# EAGLE design DorothiController (EAGLE 9.2.2)

## Sheet 1 of 3
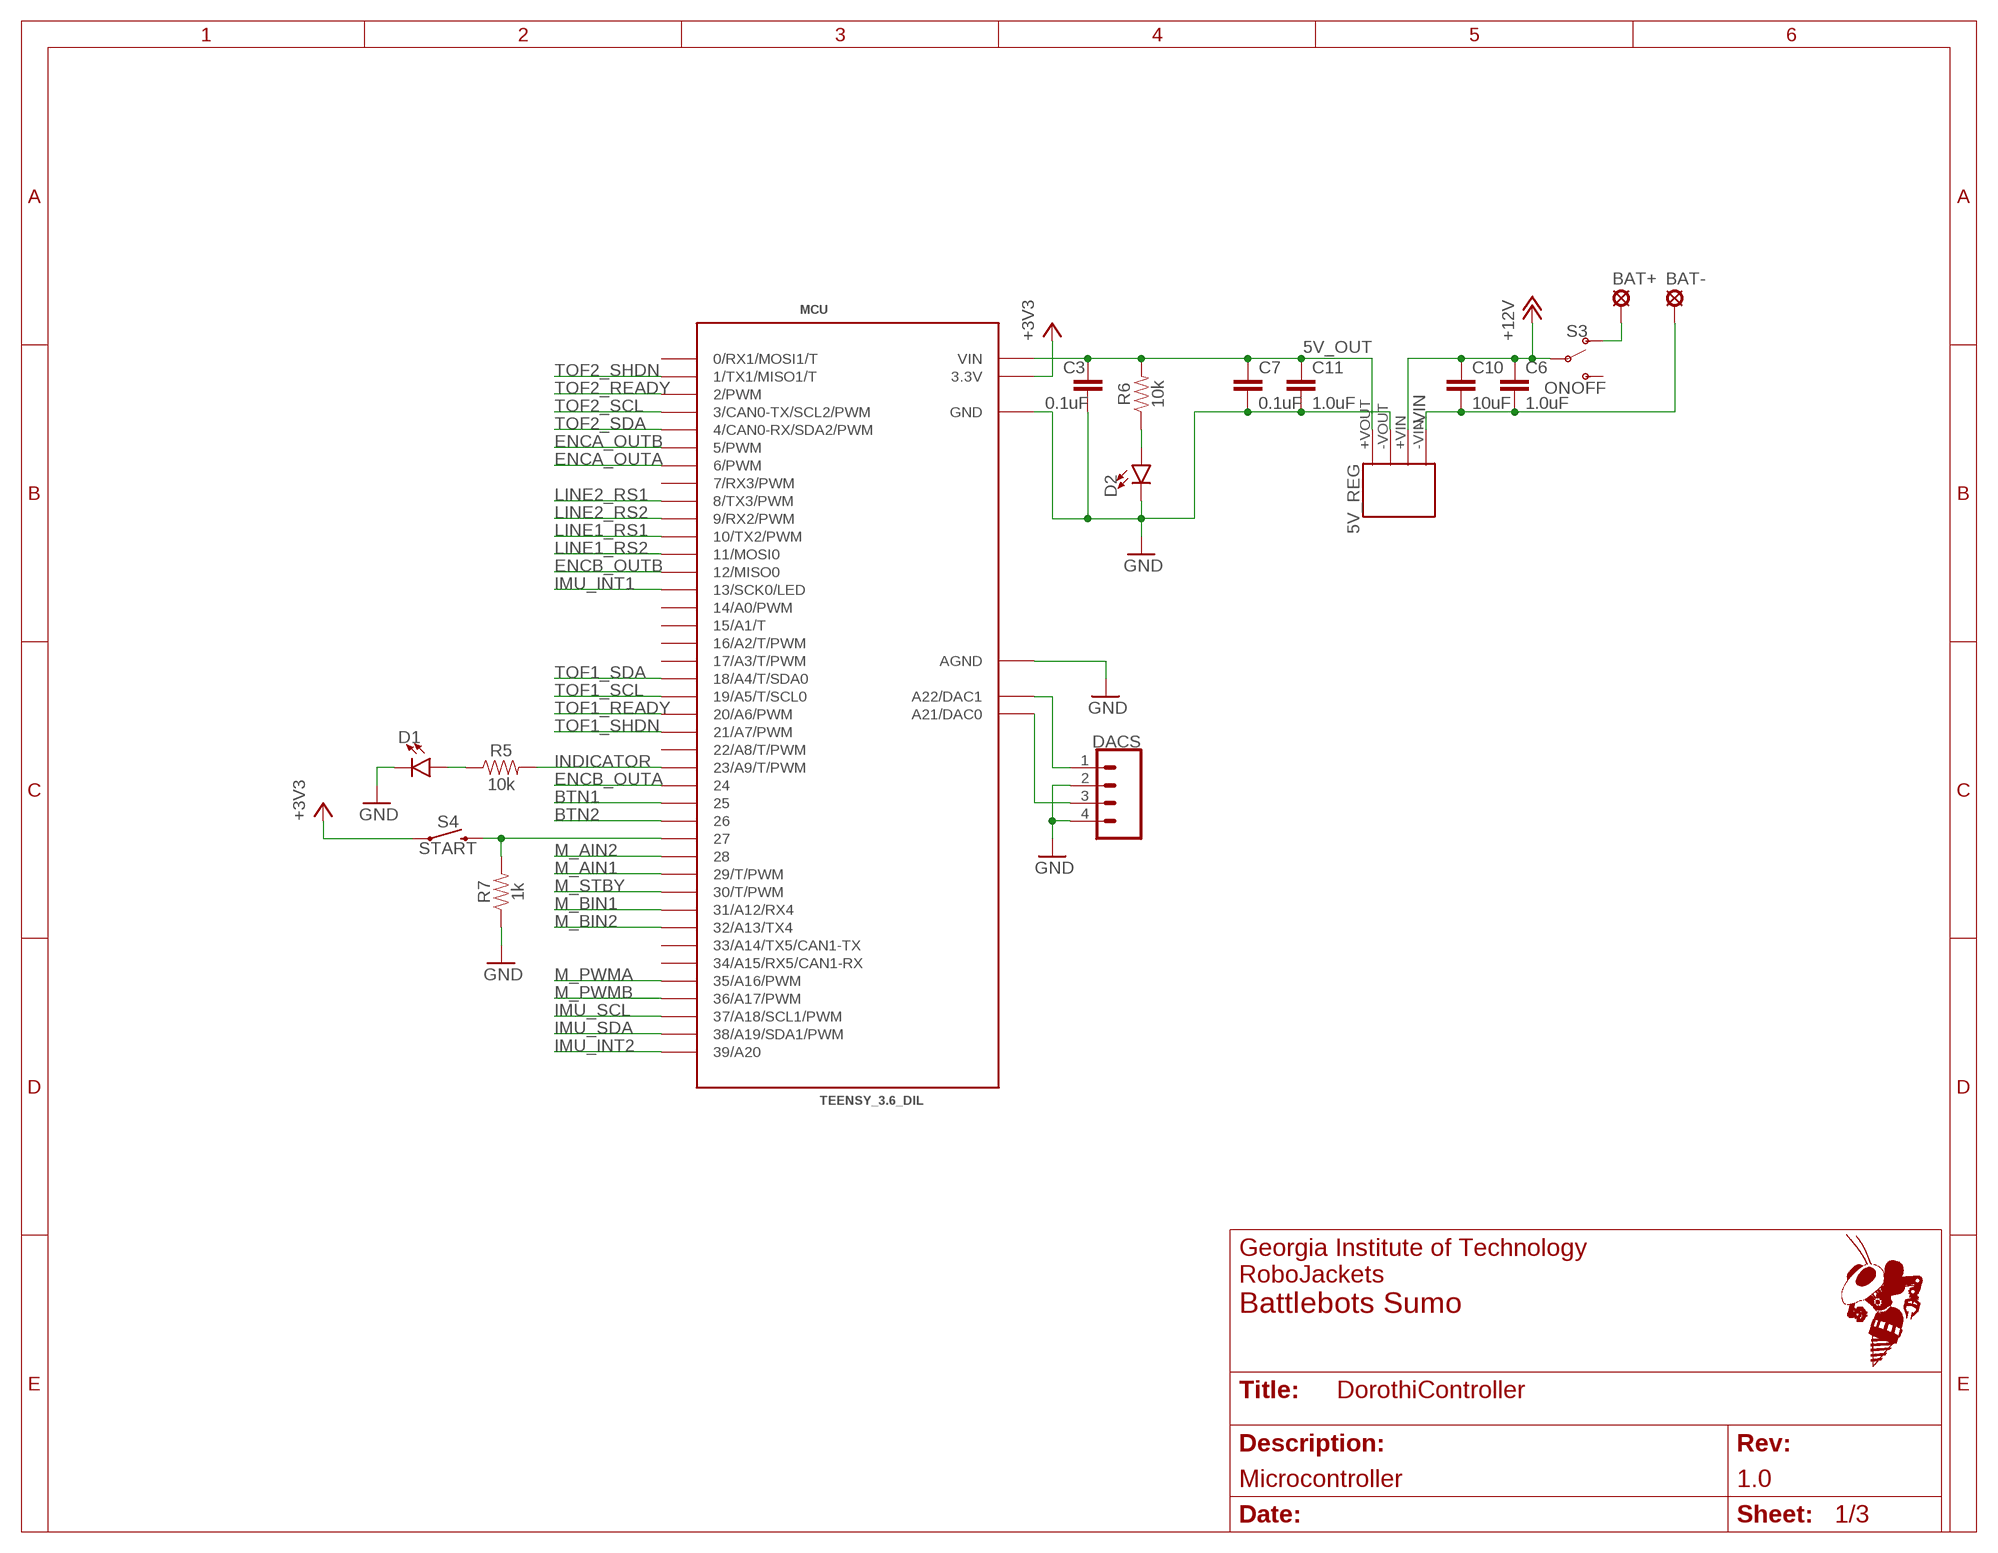
[diagram p0: schematic, sheet 1]
FRAME4 (FRAME_A_L): REVISION: 1.0; SCH_DESC: Microcontroller; TEAM: Battlebots Sumo

### Parts
5V_REG  CRE1S1205SC  [CRE1S1205SC]
BAT+  24_SOLPAD  [WIRE_SOLPAD]
BAT-  24_SOLPAD  [WIRE_SOLPAD]
C3  0.1uF  0.1UF-0603-25V-(+80/-20%)  [0603]
C6  1.0uF  1.0UF-0603-16V-10%  [0603]
C7  0.1uF  0.1UF-0603-25V-(+80/-20%)  [0603]
C10  10uF  10UF-0603-6.3V-20%  [0603]
C11  1.0uF  1.0UF-0603-16V-10%  [0603]
D1  LED0603  [LED-0603]
D2  LED0603  [LED-0603]
DACS  CONN_04  [1X04]
MCU  TEENSY_3.6_DIL  [TEENSY_3.6_DIL]
R5  10k  10KOHM-0603-1/10W-1%  [0603]
R6  10k  10KOHM-0603-1/10W-1%  [0603]
R7  1k  1KOHM-0603-1/10W-1%  [0603]
S3  ONOFF  SWITCH-SPDT-PTH-11.6X4.0MM  [SWITCH_SPDT_PTH_11.6X4.0MM]
S4  START  MOMENTARY-SWITCH-SPST-SMD-6.0X3.5MM  [TACTILE_SWITCH_SMD_6.0X3.5MM]

### Nets
5V_OUT: 5V_REG.+VOUT C3.1 C7.1 C11.1 MCU.VIN R6.2
+3V3: MCU.3.3V MCU.3.3V3(3.3V) S4.1 ; also sheet 2,3
+12V: 5V_REG.+VIN C6.1 C10.1 S3.2(P) ; also sheet 2
+VIN: BAT+.P$1(MP) S3.1(O)
-VIN: 5V_REG.-VIN BAT-.P$1(MP) C6.2 C10.2
BTN1: MCU.25 ; also sheet 3
BTN2: MCU.26 ; also sheet 3
DAC1: DACS.1 MCU.A22(A22/DAC1)
DAC2: DACS.3 MCU.A21(A21/DAC0)
ENCA_OUTA: MCU.6(6/PWM) ; also sheet 2
ENCA_OUTB: MCU.5(5/PWM) ; also sheet 2
ENCB_OUTA: MCU.24 ; also sheet 2
ENCB_OUTB: MCU.12(12/MISO0) ; also sheet 2
GND: 5V_REG.-VOUT C3.2 C7.2 C11.2 D1.C D2.C DACS.2 DACS.4 MCU.AGND MCU.GND MCU.GND1(GND) R7.1 ; also sheet 2,3
IMU_INT1: MCU.13(13/SCK0/LED) ; also sheet 3
IMU_INT2: MCU.39/A20 ; also sheet 3
IMU_SCL: MCU.37/A18(37/A18/SCL1/PWM) ; also sheet 3
IMU_SDA: MCU.38/A19(38/A19/SDA1/PWM) ; also sheet 3
INDICATOR: MCU.23/A9(23/A9/T/PWM) R5.2
LINE1_RS1: MCU.10(10/TX2/PWM) ; also sheet 3
LINE1_RS2: MCU.11(11/MOSI0) ; also sheet 3
LINE2_RS1: MCU.8(8/TX3/PWM) ; also sheet 3
LINE2_RS2: MCU.9(9/RX2/PWM) ; also sheet 3
M_AIN1: MCU.29(29/T/PWM) ; also sheet 2
M_AIN2: MCU.28 ; also sheet 2
M_BIN1: MCU.31/A12(31/A12/RX4) ; also sheet 2
M_BIN2: MCU.32/A13(32/A13/TX4) ; also sheet 2
M_PWMA: MCU.35/A16(35/A16/PWM) ; also sheet 2
M_PWMB: MCU.36/A17(36/A17/PWM) ; also sheet 2
M_STBY: MCU.30(30/T/PWM) ; also sheet 2
N$5: D1.A R5.1
N$7: D2.A R6.1
START: MCU.27 R7.2 S4.2
TOF1_READY: MCU.20/A6(20/A6/PWM) ; also sheet 3
TOF1_SCL: MCU.19/A5(19/A5/T/SCL0) ; also sheet 3
TOF1_SDA: MCU.18/A4(18/A4/T/SDA0) ; also sheet 3
TOF1_SHDN: MCU.21/A7(21/A7/PWM) ; also sheet 3
TOF2_READY: MCU.2(2/PWM) ; also sheet 3
TOF2_SCL: MCU.3(3/CAN0-TX/SCL2/PWM) ; also sheet 3
TOF2_SDA: MCU.4(4/CAN0-RX/SDA2/PWM) ; also sheet 3
TOF2_SHDN: MCU.1(1/TX1/MISO1/T) ; also sheet 3
Unconnected: MCU.0(0/RX1/MOSI1/T) MCU.7(7/RX3/PWM) MCU.14/A0(14/A0/PWM) MCU.15/A1(15/A1/T) MCU.16/A2(16/A2/T/PWM) MCU.17/A3(17/A3/T/PWM) MCU.22/A8(22/A8/T/PWM) MCU.33/A14(33/A14/TX5/CAN1-TX) MCU.34/A15(34/A15/RX5/CAN1-RX) S3.3(S)

## Sheet 2 of 3
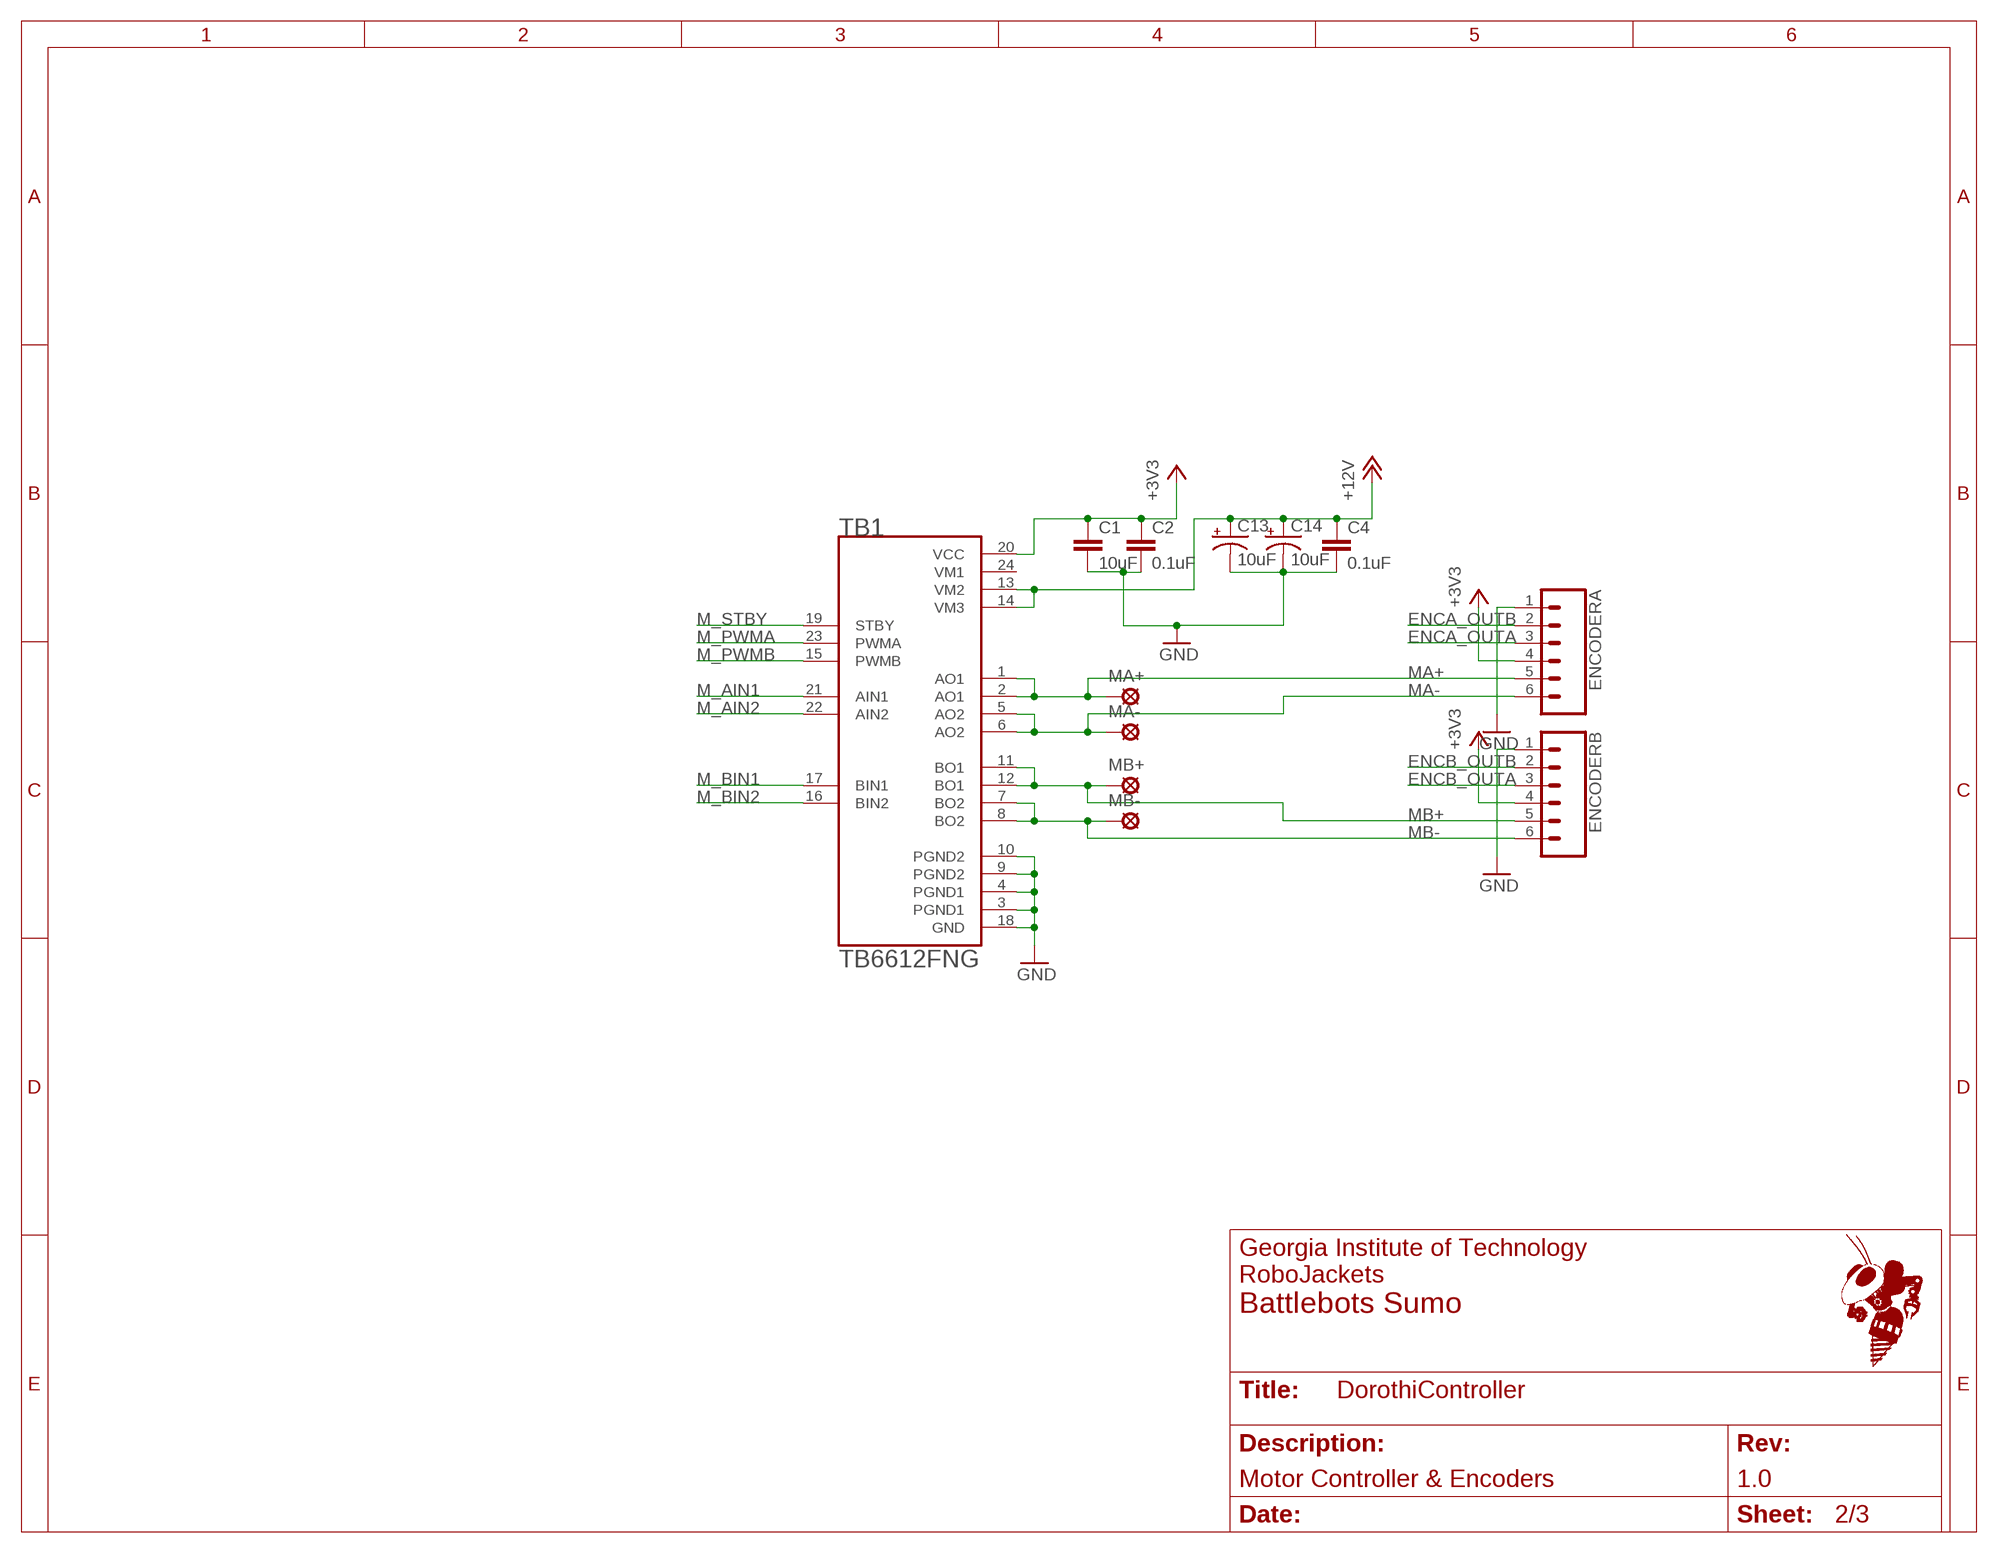
[diagram p1: schematic, sheet 2]
FRAME1 (FRAME_A_L): REVISION: 1.0; SCH_DESC: Motor Controller & Encoders; TEAM: Battlebots Sumo

### Parts
C1  10uF  10UF-0603-6.3V-20%  [0603]
C2  0.1uF  0.1UF-0603-25V-5%  [0603]
C4  0.1uF  0.1UF-0603-25V-5%  [0603]
C13  10uF  10UF-POLAR-0603-6.3V-20%(TANT)  [0603-POLAR]
C14  10uF  10UF-POLAR-0603-6.3V-20%(TANT)  [0603-POLAR]
ENCODERA  CONN_06SILK_FEMALE_PTH  [1X06]
ENCODERB  CONN_06SILK_FEMALE_PTH  [1X06]
MA+  24_SOLPAD  [WIRE_SOLPAD]
MA-  24_SOLPAD  [WIRE_SOLPAD]
MB+  24_SOLPAD  [WIRE_SOLPAD]
MB-  24_SOLPAD  [WIRE_SOLPAD]
TB1  TB6612FNG  TB6612FNG(O,C,8,EL  [SOP65P760X160-24N]

### Nets
+3V3: C1.1 C2.1 ENCODERA.4 ENCODERB.4 TB1.20(VCC) ; also sheet 1,3
+12V: C4.1 C13.+ C14.+ TB1.13(VM2) TB1.14(VM3) ; also sheet 1
ENCA_OUTA: ENCODERA.3 ; also sheet 1
ENCA_OUTB: ENCODERA.2 ; also sheet 1
ENCB_OUTA: ENCODERB.3 ; also sheet 1
ENCB_OUTB: ENCODERB.2 ; also sheet 1
GND: C1.2 C2.2 C4.2 C13.- C14.- ENCODERA.1 ENCODERB.1 TB1.3(PGND1) TB1.4(PGND1) TB1.9(PGND2) TB1.10(PGND2) TB1.18(GND) ; also sheet 1,3
M_AIN1: TB1.21(AIN1) ; also sheet 1
M_AIN2: TB1.22(AIN2) ; also sheet 1
M_BIN1: TB1.17(BIN1) ; also sheet 1
M_BIN2: TB1.16(BIN2) ; also sheet 1
M_PWMA: TB1.23(PWMA) ; also sheet 1
M_PWMB: TB1.15(PWMB) ; also sheet 1
M_STBY: TB1.19(STBY) ; also sheet 1
MA+: ENCODERA.5 MA+.P$1(MP) TB1.1(AO1) TB1.2(AO1)
MA-: ENCODERA.6 MA-.P$1(MP) TB1.5(AO2) TB1.6(AO2)
MB+: ENCODERB.5 MB+.P$1(MP) TB1.11(BO1) TB1.12(BO1)
MB-: ENCODERB.6 MB-.P$1(MP) TB1.7(BO2) TB1.8(BO2)

## Sheet 3 of 3
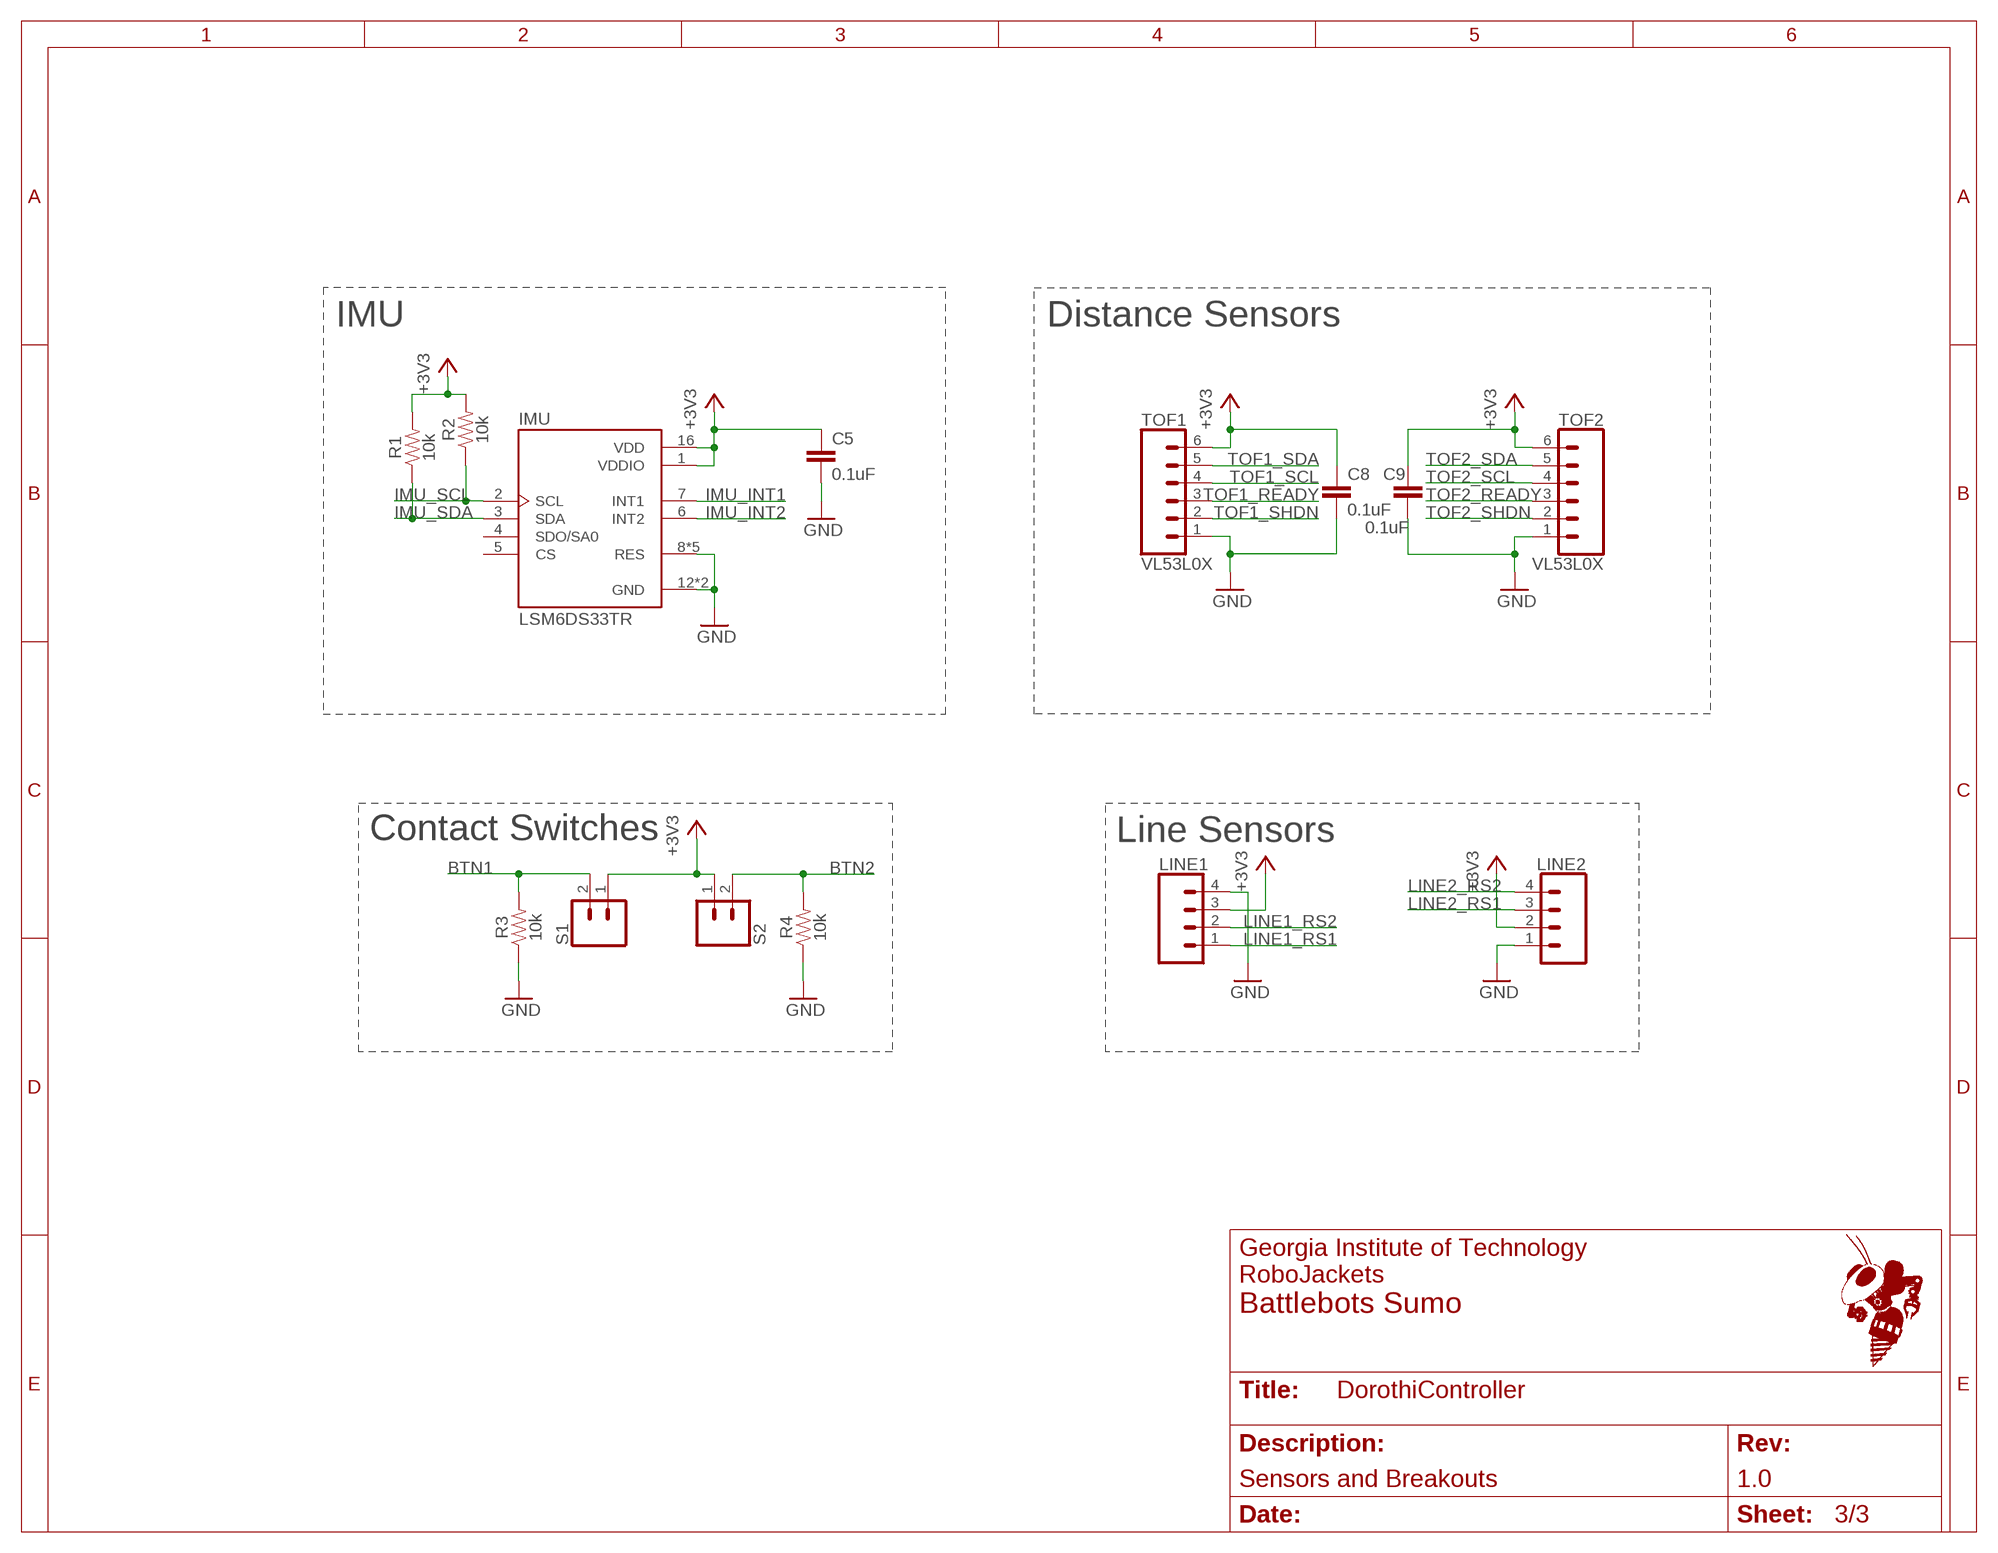
[diagram p2: schematic, sheet 3]
FRAME2 (FRAME_A_L): REVISION: 1.0; SCH_DESC: Sensors and Breakouts; TEAM: Battlebots Sumo

### Parts
C5  0.1uF  0.1UF-0603-25V-5%  [0603]
C8  0.1uF  0.1UF-0603-25V-5%  [0603]
C9  0.1uF  0.1UF-0603-25V-5%  [0603]
IMU  LSM6DS33TR  [PQFN50P300X300X86-16N]
LINE1  CONN_04  [1X04]
LINE2  CONN_04  [1X04]
R1  10k  10KOHM-0603-1/10W-1%  [0603]
R2  10k  10KOHM-0603-1/10W-1%  [0603]
R3  10k  10KOHM-0603-1/10W-1%  [0603]
R4  10k  10KOHM-0603-1/10W-1%  [0603]
S1  CONN_02  [1X02]
S2  CONN_02  [1X02]
TOF1  VL53L0X  CONN_06SILK_FEMALE_PTH  [1X06]
TOF2  VL53L0X  CONN_06SILK_FEMALE_PTH  [1X06]

### Nets
+3V3: C5.1 C8.1 C9.1 IMU.1(VDDIO) IMU.16(VDD) LINE1.3 LINE2.2 R1.2 R2.2 S1.1 S2.1 TOF1.6 TOF2.6 ; also sheet 1,2
BTN1: R3.2 S1.2 ; also sheet 1
BTN2: R4.2 S2.2 ; also sheet 1
GND: C5.2 C8.2 C9.2 IMU.8(RES) IMU.9(RES) IMU.10(RES) IMU.11(RES) IMU.12(GND) IMU.13(GND) IMU.15(RES) LINE1.4 LINE2.1 R3.1 R4.1 TOF1.1 TOF2.1 ; also sheet 1,2
IMU_INT1: IMU.7(INT1) ; also sheet 1
IMU_INT2: IMU.6(INT2) ; also sheet 1
IMU_SCL: IMU.2(SCL) R2.1 ; also sheet 1
IMU_SDA: IMU.3(SDA) R1.1 ; also sheet 1
LINE1_RS1: LINE1.1 ; also sheet 1
LINE1_RS2: LINE1.2 ; also sheet 1
LINE2_RS1: LINE2.3 ; also sheet 1
LINE2_RS2: LINE2.4 ; also sheet 1
TOF1_READY: TOF1.3 ; also sheet 1
TOF1_SCL: TOF1.4 ; also sheet 1
TOF1_SDA: TOF1.5 ; also sheet 1
TOF1_SHDN: TOF1.2 ; also sheet 1
TOF2_READY: TOF2.3 ; also sheet 1
TOF2_SCL: TOF2.4 ; also sheet 1
TOF2_SDA: TOF2.5 ; also sheet 1
TOF2_SHDN: TOF2.2 ; also sheet 1
Unconnected: IMU.4(SDO/SA0) IMU.5(CS)

### Notes on the sheet
- IMU | Distance Sensors
- Contact Switches | Line Sensors

## Power pins joined to a net without a drawn wire
VM1: TB1.24(VM1)

## Library data of the parts
5V_REG = CRE1S1205SC:CRE1S1205SC
BAT+ BAT- MA+ MA- MB+ MB- = nickZhang:2*4_SOLPAD: SOLDER PAD RTM, drill 1,1mm, distributor Buerklin, 07F810
C1 C10 = SparkFun-Capacitors:10UF: 10.0µF ceramic capacitors A capacitor is a passive two-terminal electrical component used to store electrical energy temporarily in an electric field.; PROD_ID: CAP-11015
C2 C4 C5 C8 C9 = SparkFun-Capacitors:0.1UF: 0.1µF ceramic capacitors A capacitor is a passive two-terminal electrical component used to store electrical energy temporarily in an electric field.; PROD_ID: CAP-08604
C3 C7 = SparkFun-Capacitors:0.1UF: 0.1µF ceramic capacitors A capacitor is a passive two-terminal electrical component used to store electrical energy temporarily in an electric field.; PROD_ID: CAP-00810
C6 C11 = SparkFun-Capacitors:1.0UF: 1µF ceramic capacitors A capacitor is a passive two-terminal electrical component used to store electrical energy temporarily in an electric field.; PROD_ID: CAP-00868
C13 C14 = SparkFun-Capacitors:10UF-POLAR: 10.0µF polarized capacitors A capacitor is a passive two-terminal electrical component used to store electrical energy temporarily in an electric field.; PROD_ID: CAP-13210
D1 D2 = SparkFun-LED:LED: LED (Generic) Standard schematic elements and footprints for 5mm, 3mm, 1206, and 0603 sized LEDs. Generic LEDs with no color specified.
DACS LINE1 LINE2 = SparkFun-Connectors:CONN_04: Multi connection point. Often used as Generic Header-pin footprint for 0.1 inch spaced/style header connections On any of the 0.1 inch spaced packages, you can populate with these: Break Away Headers - Straight <https://www.sparkfun.com/products/116> (PRT-00116) Break Away Male Headers - Right Angle <https://www.sparkfun.com/products/553> (PRT-00553) Female Headers <https://www.sparkfun.com/products/115> (PRT-00115) Break Away Headers - Machine Pin <https://www.sparkfun.com/products/117> (PRT-00117) Break Away Female Headers - Swiss Machine Pin <https://www.sparkfun.com/products/743> (PRT-00743) For SCREWTERMINALS and SPRING TERMINALS visit here: Screw Terimnals on SparkFun.com <https://www.sparkfun.com/search/results?term=Screw+Terminals> (5mm/3.5mm/2.54mm spacing) This device is also useful as a general connection point to wire up your design to another part of your project. Our various solder wires solder well into these plated through hole pads. Hook-Up Wire - Assortment (Stranded, 22 AWG) <https://www.sparkfun.com/products/11375> (PRT-11375) Hook-Up Wire - Assortment (Solid Core, 22 AWG) <https://www.sparkfun.com/products/11367> (PRT-11367) View the entire wire category on our website here <https://www.sparkfun.com/categories/141> Special notes: Molex polarized connector foot print use with SKU : PRT-08231 with associated crimp pins and housings. 1MM SMD Version SKU: PRT-10208; PROD_ID: CONN-09696
ENCODERA ENCODERB TOF1 TOF2 = SparkFun-Connectors:CONN_06: Multi connection point. Often used as Generic Header-pin footprint for 0.1 inch spaced/style header connections On any of the 0.1 inch spaced packages, you can populate with these: Break Away Headers - Straight <https://www.sparkfun.com/products/116> (PRT-00116) Break Away Male Headers - Right Angle <https://www.sparkfun.com/products/553> (PRT-00553) Female Headers <https://www.sparkfun.com/products/115> (PRT-00115) Break Away Headers - Machine Pin <https://www.sparkfun.com/products/117> (PRT-00117) Break Away Female Headers - Swiss Machine Pin <https://www.sparkfun.com/products/743> (PRT-00743) Arduino Stackable Header - 6 Pin <https://www.sparkfun.com/products/9280> (PRT-09280) For SCREWTERMINALS and SPRING TERMINALS visit here: Screw Terimnals on SparkFun.com <https://www.sparkfun.com/search/results?term=Screw+Terminals> (5mm/3.5mm/2.54mm spacing) This device is also useful as a general connection point to wire up your design to another part of your project. Our various solder wires solder well into these plated through hole pads. Hook-Up Wire - Assortment (Stranded, 22 AWG) <https://www.sparkfun.com/products/11375> (PRT-11375) Hook-Up Wire - Assortment (Solid Core, 22 AWG) <https://www.sparkfun.com/products/11367> (PRT-11367) View the entire wire category on our website here <https://www.sparkfun.com/categories/141>; PROD_ID: CONN-08437
IMU = LSM6DS33TR:LSM6DS33TR: Integrated Circuit, Misc s 3d Accelerometer And Gyro Lsm6ds3; AVAILABILITY: Unavailable; DESCRIPTION: Integrated Circuit, Misc s 3d Accelerometer And Gyro Lsm6ds3; MF: STMicroelectronics; MP: LSM6DS33TR; PACKAGE: LGA-16 STMicroelectronics; PRICE: None
MCU = Teensy_3_and_LC_Series_Boards_v1.4:TEENSY_3.6_DIL: Teensy 3.6 DIL Package
R1-R6 = SparkFun-Resistors:10KOHM: 10kΩ resistor A resistor is a passive two-terminal electrical component that implements electrical resistance as a circuit element. Resistors act to reduce current flow, and, at the same time, act to lower voltage levels within circuits. - Wikipedia; PROD_ID: RES-00824
R7 = SparkFun-Resistors:1KOHM: 1kΩ resistor A resistor is a passive two-terminal electrical component that implements electrical resistance as a circuit element. Resistors act to reduce current flow, and, at the same time, act to lower voltage levels within circuits. - Wikipedia; PROD_ID: RES-07856
S1 S2 = SparkFun-Connectors:CONN_02: Multi connection point. Often used as Generic Header-pin footprint for 0.1 inch spaced/style header connections On any of the 0.1 inch spaced packages, you can populate with these: Break Away Headers - Straight <https://www.sparkfun.com/products/116> (PRT-00116) Break Away Male Headers - Right Angle <https://www.sparkfun.com/products/553> (PRT-00553) Female Headers <https://www.sparkfun.com/products/115> (PRT-00115) Break Away Headers - Machine Pin <https://www.sparkfun.com/products/117> (PRT-00117) Break Away Female Headers - Swiss Machine Pin <https://www.sparkfun.com/products/743> (PRT-00743) For SCREWTERMINALS and SPRING TERMINALS visit here: Screw Terimnals on SparkFun.com <https://www.sparkfun.com/search/results?term=Screw+Terminals> (5mm/3.5mm/2.54mm spacing) This device is also useful as a general connection point to wire up your design to another part of your project. Our various solder wires solder well into these plated through hole pads. Hook-Up Wire - Assortment (Stranded, 22 AWG) <https://www.sparkfun.com/products/11375> (PRT-11375) Hook-Up Wire - Assortment (Solid Core, 22 AWG) <https://www.sparkfun.com/products/11367> (PRT-11367) View the entire wire category on our website here <https://www.sparkfun.com/categories/141> Special notes: Molex polarized connector foot print use with: PRT-08233 with associated crimp pins and housings. 2.54_SCREWTERM for use with PRT-10571. 3.5mm Screw Terminal footprints for PRT-08084 5mm Screw Terminal footprints for use with PRT-08432
S3 = SparkFun-Switches:SWITCH-SPDT: Single Pole, Double Throw (SPDT) Switch Single-pole, double-throw (SPDT) switch. Variant Overview SMD-AYZ0202 Surface Mount DPDT Switch <https://www.sparkfun.com/products/597> (COM-00597) Used on e.g. LilyPad Arduino USB - ATmega32U4 Board <https://www.sparkfun.com/products/12049> PTH-11.6X4.0MM SPDT Mini Power Switch <https://www.sparkfun.com/products/102> (COM-00102) Used on e.g. SparkFun Simon Says - Through-Hole Soldering Kit <https://www.sparkfun.com/products/10547> (KIT-10547) PTH-11.6X4.0MM-KIT KIT version of SPDT Mini Power Switch - Simplifies soldering by removing tStop of switch pins - only one side can be soldered. PTH-11.6X4.0MM-LOCK LOCK version of SPDT Mini Power Switch - Offset pins hold switch in place for easier soldering. SMD-RIGHT-ANGLE Surface Mount Right Angle Switch <https://www.sparkfun.com/products/10860> (COM-10860) Used on e.g. SparkFun ESP8266 Thing <https://www.sparkfun.com/products/13231>; PROD_ID: SWCH-08261; SF_SKU: COM-00102
S4 = SparkFun-Switches:MOMENTARY-SWITCH-SPST: Momentary Switch (Pushbutton) - SPST Normally-open (NO) SPST momentary switches (buttons, pushbuttons). Variants PTH-12MM - 12mm square, through-hole Momentary Pushbutton Switch - 12mm Square <https://www.sparkfun.com/products/9190> (COM-09190) PTH-6.0MM, PTH-6.0MM-KIT - 6.0mm square, through-hole Mini Pushbutton Switch <https://www.sparkfun.com/products/97> (COM-00097) KIT package intended for soldering kit's - only one side of pads' copper is exposed. PTH-RIGHT-ANGLE-KIT - Right-angle, through-hole Right Angle Tactile Button <https://www.sparkfun.com/products/10791> - Used on SparkFun BigTime Watch Kit <https://www.sparkfun.com/products/11734> SMD-12MM - 12mm square, surface-mount Tactile Button - SMD (12mm) <https://www.sparkfun.com/products/12993> (COM-12993) Used on SparkFun PicoBoard <https://www.sparkfun.com/products/11888> SMD-4.5MM - 4.5mm Square Trackball Switch Used on SparkFun Blackberry Trackballer Breakout <https://www.sparkfun.com/products/13169> SMD-4.6MMX2.8MM - 4.60mm x 2.80mm, surface mount Used on SparkFun SAMD21 Mini Breakout <https://www.sparkfun.com/products/13664> SMD-5.2MM, SMD-5.2-REDUNDANT - 5.2mm square, surface-mount Mini Pushbutton Switch - SMD <https://www.sparkfun.com/products/8720> (COM-08720) Used on Arduino Pro Mini <https://www.sparkfun.com/products/11114> REDUNDANT package connects both switch circuits together SMD-6.0X3.5MM - 6.0 x 3.5mm, surface mount Momentary Reset Switch SMD <https://www.sparkfun.com/products/8229> (COM-08229) SMD-6.2MM-TALL - 6.2mm square, surface mount Tactile Button - SMD (6mm) <https://www.sparkfun.com/products/12992> Used on SparkFun Digital Sandbox <https://www.sparkfun.com/products/12651> SMD-RIGHT-ANGLE - Right-angle, surface mount Used on SparkFun Block for Intel® Edison - Arduino <https://www.sparkfun.com/products/13036>; PROD_ID: SWCH-00815; SF_SKU: COM-08229
TB1 = TB6612FNG:TB6612FNG(O,C,8,EL: Stepping Motor Driver Ic Unipolor Copper Wire 8"; AVAILABILITY: Unavailable; DESCRIPTION: Stepping Motor Driver Ic Unipolor Copper Wire 8; MF: Toshiba; MP: TB6612FNG_O,C,8,EL; PACKAGE: SSOP-24 Toshiba; PRICE: None

## Board
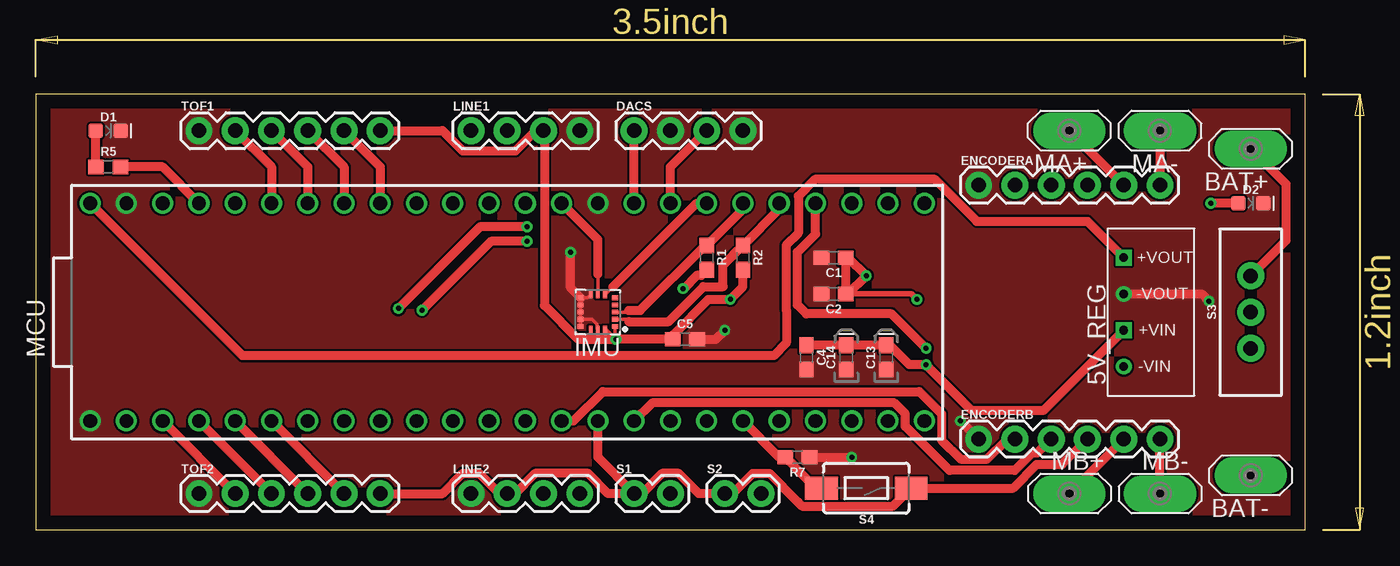
[diagram p3: board, top side]
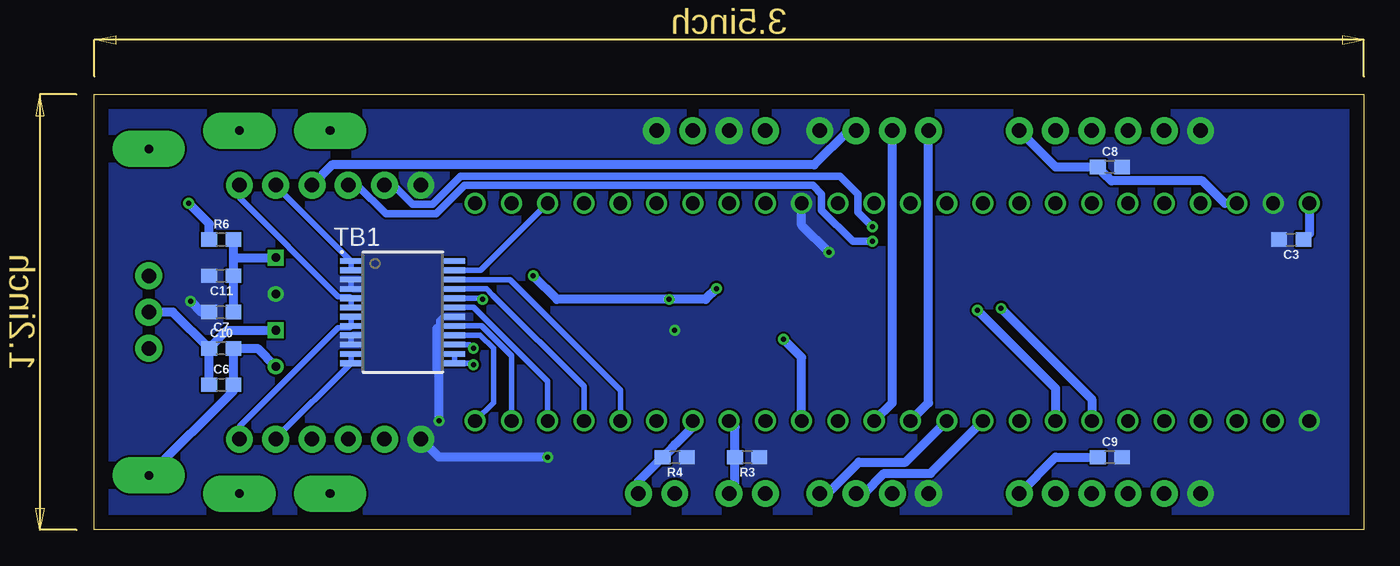
[diagram p4: board, bottom side, seen from below]

Size 88.9 x 30.48 mm. Coordinates in mm from the lower left corner, seen from the top.
Outline: 0,0 88.9,0 88.9,30.48 0,30.48 0,0
Copper layers (1*16): Top 0.035mm / dielectric 1.5mm / Bottom 0.035mm
Design rules "default": minimum track width 6mil, minimum drill 0.35mm, track to track 6mil, track to pad 6mil, pad to pad 6mil, via to via 6mil, smd to smd 6mil, copper to edge 40mil, drill to drill 6mil, minimum pad ring 10mil, minimum via ring 8mil, stop-mask expansion 4mil, vias tented up to drill 0mil, thermal gap 10mil

### Footprints (pad centres in the part's own frame; a part is rotated, then mirrored left to right if it is on the bottom)
CRE1S1205SC = drill 0.6 square: +VIN -1.27,0; +VOUT 3.81,0 | drill 0.6: -VIN -3.81,0; -VOUT 1.27,0
WIRE_SOLPAD = drill 0.6 pad 2.54 long: P$1 0,0
0603 = smd 1.1 x 1: 1 -0.85,0; 2 0.85,0
0603-POLAR = smd 1.1 x 1: + 0.85,0; - -0.85,0
LED-0603 = smd 1 x 1: A -0.877,0; C 0.877,0
1X04 = drill 1.016 pad 1.88: 1 0,0; 2 2.54,0; 3 5.08,0; 4 7.62,0
1X06 = drill 1.016 pad 1.88: 1 0,0; 2 2.54,0; 3 5.08,0; 4 7.62,0; 5 10.16,0; 6 12.7,0
PQFN50P300X300X86-16N = smd 0.51 x 0.35: 1 -1.21,1; 2 -1.21,0.5; 3 -1.21,0; 4 -1.21,-0.5; 5 -1.21,-1; 9 1.21,-1; 10 1.21,-0.5; 11 1.21,0; 12 1.21,0.5; 13 1.21,1 | smd 0.35 x 0.51: 6 -0.5,-1.21; 7 0,-1.21; 8 0.5,-1.21; 14 0.5,1.21; 15 0,1.21; 16 -0.5,1.21
TEENSY_3.6_DIL = drill 0.965: 0 -7.62,25.4; 1 -7.62,22.86; 2 -7.62,20.32; 3 -7.62,17.78; 3.3V 7.62,22.86; 3.3V3 -7.62,-7.62; 4 -7.62,15.24; 5 -7.62,12.7; 6 -7.62,10.16; 7 -7.62,7.62; 8 -7.62,5.08; 9 -7.62,2.54; 10 -7.62,0; 11 -7.62,-2.54; 12 -7.62,-5.08; 13 7.62,-5.08; 14/A0 7.62,-2.54; 15/A1 7.62,0; 16/A2 7.62,2.54; 17/A3 7.62,5.08; 18/A4 7.62,7.62; 19/A5 7.62,10.16; 20/A6 7.62,12.7; 21/A7 7.62,15.24; 22/A8 7.62,17.78; 23/A9 7.62,20.32; 24 -7.62,-10.16; 25 -7.62,-12.7; 26 -7.62,-15.24; 27 -7.62,-17.78; 28 -7.62,-20.32; 29 -7.62,-22.86; 30 -7.62,-25.4; 31/A12 -7.62,-27.94; 32/A13 -7.62,-30.48; 33/A14 7.62,-30.48; 34/A15 7.62,-27.94; 35/A16 7.62,-25.4; 36/A17 7.62,-22.86; 37/A18 7.62,-20.32; 38/A19 7.62,-17.78; 39/A20 7.62,-15.24; A21 7.62,-12.7; A22 7.62,-10.16; AGND 7.62,25.4; GND -7.62,27.94; GND1 7.62,-7.62; VIN 7.62,27.94
1X02 = drill 1.016 pad 1.88: 1 0,0; 2 2.54,0
SWITCH_SPDT_PTH_11.6X4.0MM = drill 1.016 pad 1.88: 1 0,2.54; 2 0,0; 3 0,-2.54
TACTILE_SWITCH_SMD_6.0X3.5MM = smd 2.3 x 1.6: 1 -3.15,0; 2 3.15,0
SOP65P760X160-24N = smd 1.5 x 0.4: 1 -3.625,3.575; 2 -3.625,2.925; 3 -3.625,2.275; 4 -3.625,1.625; 5 -3.625,0.975; 6 -3.625,0.325; 7 -3.625,-0.325; 8 -3.625,-0.975; 9 -3.625,-1.625; 10 -3.625,-2.275; 11 -3.625,-2.925; 12 -3.625,-3.575; 13 3.625,-3.575; 14 3.625,-2.925; 15 3.625,-2.275; 16 3.625,-1.625; 17 3.625,-0.975; 18 3.625,-0.325; 19 3.625,0.325; 20 3.625,0.975; 21 3.625,1.625; 22 3.625,2.275; 23 3.625,2.925; 24 3.625,3.575

### Placement (x,y rotation side)
5V_REG  76.2,15.24 90 top
BAT+  85.09,26.67 180 top
BAT-  85.09,3.81 180 top
C1  55.88,19.05 180 top
C2  55.88,16.51 180 top
C3  5.08,20.32 180 bottom
C4  53.98,12.06 270 top
C5  45.47,13.34 0 top
C6  80.01,10.16 0 bottom
C7  80.01,15.24 180 bottom
C8  17.78,25.4 0 bottom
C9  17.78,5.08 0 bottom
C10  80.01,12.7 0 bottom
C11  80.01,17.78 180 bottom
C13  59.56,12.06 90 top
C14  56.77,12.06 90 top
D1  5.08,27.94 0 top
D2  85.09,22.86 0 top
DACS  41.91,27.94 0 top
ENCODERA  66.04,24.13 0 top
ENCODERB  66.04,6.35 0 top
IMU  39.37,15.24 180 top
LINE1  30.48,27.94 0 top
LINE2  30.48,2.54 0 top
MA+  72.39,27.94 180 top
MA-  78.74,27.94 180 top
MB+  72.39,2.54 0 top
MB-  78.74,2.54 0 top
MCU  31.75,15.24 90 top
R1  46.99,19.05 270 top
R2  49.53,19.05 270 top
R3  43.18,5.08 180 bottom
R4  48.26,5.08 180 bottom
R5  5.08,25.4 0 top
R6  80.01,20.32 0 bottom
R7  53.34,5.08 180 top
S1  41.91,2.54 0 top
S2  48.26,2.54 0 top
S3  85.09,15.24 0 top
S4  58.17,2.92 180 top
TB1  67.31,15.24 0 bottom
TOF1  11.43,27.94 0 top
TOF2  11.43,2.54 0 top

### Tracks (layer width: path | path; a pad name or v marks a point on that pad's centre or on a via)
5V_OUT
  Top 0.635: 5V_REG.+VOUT 73.66,21.59 65.91,21.59 62.96,24.54 54.58,24.54 53.4,23.36 53.4,20.77 52.55,19.91 52.55,15.42 52.58,15.4 52.58,13.08 51.69,12.19 14.48,12.19 MCU.VIN
  Bottom 0.635: C7.1 C11.1 79.16,19.05 | 79.16,19.05 R6.2 | 79.16,19.05 5V_REG.+VOUT | MCU.VIN 3.81,20.74 C3.1
+3V3  (via drill 0.35)
  Top 0.254: IMU.1 40.58,13.39 | 40.58,13.39 v40.64,13.34 | IMU.16 39.95,14.03 40.58,13.39
  Top 0.381: v61.72,16.13 61.34,16.51 C2.1
  Top 0.635: S1.1 42.46,2.54 43.87,3.95 45.03,3.95 46.44,2.54 S2.1 48.81,2.54 50.22,3.95 51.38,3.95 53.4,1.94 53.4,1.93 53.67,1.65 60.05,1.65 S4.1 68.45,2.92 70.1,4.57 71.88,4.57 ENCODERB.4 | S1.1 39.37,5.08 MCU.3.3V3 | S1.1 40.09,2.54 38.68,3.95 34.98,3.95 33.57,2.54 LINE2.2 32.47,2.54 31.06,3.95 29.9,3.95 28.49,2.54 TOF2.6 | TOF1.6 28.49,27.94 29.9,26.53 33.6,26.53 35.01,27.94 LINE1.3 35.62,27.88 35.62,15.71 38.03,13.3 40.59,13.3 40.62,13.34 v40.64,13.34 C5.1 44.62,13.63 47.12,16.13 v48.64,16.13 49.53,17.02 R2.2 | R1.2 46.59,17.8 46.31,17.8 45.39,16.89 v45.34,16.89 | C2.1 C1.1 56.9,19.05 v58.17,17.78 56.9,16.51 C2.1
  Bottom 0.381: TB1.20 61.81,16.21 v61.72,16.13
  Bottom 0.635: TOF2.6 21.59,5.08 C9.1 | TOF1.6 21.59,25.4 C8.1 17.95,24.72 17.95,24.7 17.68,24.43 11.29,24.43 9.72,22.86 MCU.3.3V | LINE1.3 36.11,27.94 38.51,25.54 72.25,25.54 ENCODERA.4 | MCU.3.3V3 39.37,12.06 v40.64,13.34 | v45.34,16.89 46.1,16.13 v48.64,16.13 56.52,16.13 v58.17,17.78
+12V  (via drill 0.35)
  Top 0.635: C4.1 C14.+ C13.+ 59.82,12.91 61.17,11.56 v62.36,11.56 65.53,8.38 70.61,8.38 5V_REG.+VIN
  Bottom 0.381: v62.36,11.56 62.47,11.66 TB1.13 TB1.14
  Bottom 0.635: C10.1 83.4,15.24 S3.2 | C6.1 C10.1 | C10.1 80.18,13.38 80.18,13.39 79.61,13.97 5V_REG.+VIN
+VIN
  Top 0.635: S3.1 87.57,20.26 87.57,24.19 BAT+.P$1
-VIN
  Bottom 0.635: BAT-.P$1 79.16,9.74 C6.2 C10.2 77.47,12.7 5V_REG.-VIN
BTN1
  Bottom 0.635: S1.2 44.03,2.96 R3.2 44.03,7.2 MCU.25
BTN2
  Bottom 0.635: S2.2 50.8,3.39 R4.2 48.43,5.76 48.43,5.78 48.16,6.05 48.14,6.05 46.99,7.2 MCU.26
DAC1
  Top 0.635: MCU.A22 DACS.1
DAC2
  Top 0.635: MCU.A21 44.45,25.4 DACS.3
ENCA_OUTA  (via drill 0.35)
  Top 0.635: v34.42,20.19 31.88,20.19 v27.05,15.37
  Bottom 0.508: ENCODERA.3 70.48,24.13 68.48,22.12 64.95,22.12 62.97,24.11 38.58,24.11 37.97,23.5 37.97,22.39 35.78,20.19 v34.42,20.19
  Bottom 0.635: v27.05,15.37 21.59,9.91 MCU.6
ENCA_OUTB  (via drill 0.35)
  Top 0.635: v34.42,21.21 31.11,21.21 v25.4,15.49
  Bottom 0.508: ENCODERA.2 67.94,24.13 66.6,22.78 65.23,22.78 63.25,24.77 36.7,24.77 35.43,23.5 35.43,22.23 v34.42,21.21
  Bottom 0.635: v25.4,15.49 19.05,9.14 MCU.5
ENCB_OUTA
  Top 0.635: ENCODERB.3 70.13,5.36 69.78,5.36 68.57,4.15 63.99,4.15 60.9,7.25 60.9,8.12 60.13,8.89 43.18,8.89 MCU.24
ENCB_OUTB
  Top 0.635: ENCODERB.2 68.03,6.35 66.62,4.94 64.78,4.94 63.44,6.29 63.44,8.12 61.88,9.68 39.72,9.68 37.66,7.62 MCU.12
GND  (via drill 0.35)
  Top 0.254: IMU.15 39.32,14.08 39.32,14.38 38.96,14.74 38.95,14.73 IMU.12 | IMU.8 38.66,16.24 IMU.9 IMU.10 IMU.11 IMU.12 | IMU.13 IMU.12
  Top 0.635: 5V_REG.-VOUT 81.66,16.51 v82.17,16 | R7.1 v57.15,5.08 | IMU.9 37.47,16.93 v37.47,19.43 | C5.2 47.62,13.34 v48.26,13.97 | ENCODERB.1 v64.77,7.62
  Bottom 0.381: TB1.4 TB1.3 | TB1.10 TB1.9 | 64.91,14.1 64.78,14.22 64.78,14.61 64.47,14.91 TB1.18
  Bottom 0.635: v82.17,16 81.41,15.24 C7.2 | v57.15,5.08 64.77,5.08 ENCODERB.1 | v37.47,19.43 39.37,21.34 MCU.GND1 | v64.77,7.62 64.77,11.13 64.91,11.27 64.91,14.1
  pour Top (no thermals): 0,30.48 0,0 88.9,0 88.9,30.48
  pour Bottom (no thermals): 0,30.48 0,0 88.9,0 88.9,30.48
IMU_INT1
  Top 0.254: IMU.7 39.37,17.91
  Top 0.635: 39.37,17.91 39.37,20.32 MCU.13
IMU_INT2
  Top 0.254: IMU.6 40.41,16.99
  Top 0.635: 40.41,16.99 46.28,22.86 MCU.39/A20
IMU_SCL
  Top 0.254: IMU.2 41.37,14.74 41.53,14.58
  Top 0.635: MCU.37/A18 52.07,22.44 R2.1 48.85,19.22 48.84,19.22 48.13,18.52 48.13,17.02 46.76,17.02 44.32,14.58 41.53,14.58
IMU_SDA
  Top 0.254: IMU.3 41.4,15.24 41.53,15.37
  Top 0.635: MCU.38/A19 49.53,22.44 R1.1 46.86,19.9 42.33,15.37 41.53,15.37
INDICATOR
  Top 0.635: MCU.23/A9 8.89,25.4 R5.2
LINE1_RS1
  Bottom 0.635: MCU.10 30.48,8.89 LINE1.1
LINE1_RS2
  Bottom 0.635: MCU.11 33.02,8.89 LINE1.2
LINE2_RS1
  Bottom 0.635: MCU.8 30.34,3.95 33.6,3.95 35.01,2.54 LINE2.3
LINE2_RS2
  Bottom 0.635: MCU.9 32.09,4.74 35.36,4.74 37.55,2.54 LINE2.4
M_AIN1
  Bottom 0.381: TB1.21 61.44,16.86 61,16.43 61,16.42 54.61,10.03 MCU.29
M_AIN2
  Bottom 0.381: TB1.22 59.81,17.52 52.07,9.78 MCU.28
M_BIN1
  Bottom 0.381: TB1.17 63.66,14.29 61.79,14.29 59.69,12.18 MCU.31/A12
M_BIN2
  Bottom 0.381: TB1.16 61.88,13.62 60.96,12.7 60.96,8.89 MCU.32/A13
M_PWMA
  Bottom 0.381: TB1.23 61.84,18.16 MCU.35/A16
M_PWMB  (via drill 0.35)
  Top 0.635: v62.36,12.7 59.94,15.11 53.98,15.11 53.34,15.75 53.34,19.43 54.61,20.7 MCU.36/A17
  Bottom 0.381: TB1.15 62.62,12.96 v62.36,12.7
M_STBY
  Bottom 0.381: TB1.19 63.66,15.59 62.34,15.59 57.15,10.4 MCU.30
MA+
  Top 0.635: MA+.P$1 ENCODERA.5
  Bottom 0.381: TB1.2 TB1.1 76.2,24.08 ENCODERA.5
MA-
  Top 0.635: MA-.P$1 ENCODERA.6
  Bottom 0.381: TB1.6 TB1.5 71.04,16.32 71.83,16.32 78.74,23.23 ENCODERA.6
MB+
  Top 0.635: MB+.P$1 ENCODERB.5
  Bottom 0.381: TB1.11 TB1.12 76.2,6.4 ENCODERB.5
MB-
  Top 0.635: MB-.P$1 ENCODERB.6
  Bottom 0.381: TB1.7 TB1.8 71.04,14.16 71.83,14.16 78.74,7.25 ENCODERB.6
N$5
  Top 0.635: R5.1 4.2,25.43 D1.A
N$7  (via drill 0.35)
  Top 0.635: D2.A v82.3,22.86
  Bottom 0.635: R6.1 80.86,21.42 v82.3,22.86
START
  Top 0.635: S4.2 54.63,2.92 53.17,4.38 53.17,4.4 R7.2 52.07,5.08 MCU.27
TOF1_READY
  Top 0.635: TOF1.3 19.05,25.4 MCU.20/A6
TOF1_SCL
  Top 0.635: TOF1.4 21.59,25.4 MCU.19/A5
TOF1_SDA
  Top 0.635: TOF1.5 24.13,25.4 MCU.18/A4
TOF1_SHDN
  Top 0.635: TOF1.2 16.51,25.4 MCU.21/A7
TOF2_READY
  Top 0.635: TOF2.3 MCU.2
TOF2_SCL
  Top 0.635: TOF2.4 MCU.3
TOF2_SDA
  Top 0.635: TOF2.5 MCU.4
TOF2_SHDN
  Top 0.635: TOF2.2 MCU.1